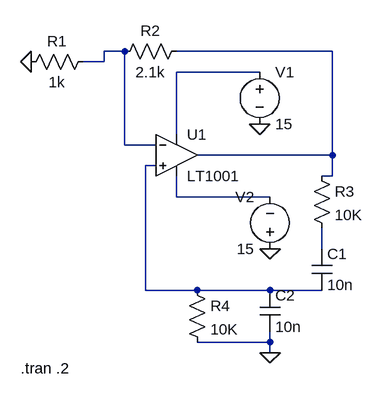
[diagram p0: schematic WEIN BRIDGE.asc]
WEIN BRIDGE.asc, the LTspice schematic file:
Version 4
SHEET 1 880 680
WIRE 128 0 96 0
WIRE 448 0 208 0
WIRE 96 16 96 0
WIRE 96 16 64 16
WIRE 336 32 208 32
WIRE 208 128 208 32
WIRE 128 144 128 0
WIRE 176 144 128 144
WIRE 448 160 448 0
WIRE 448 160 240 160
WIRE 176 176 160 176
WIRE 448 192 448 160
WIRE 448 192 432 192
WIRE 208 224 208 192
WIRE 352 224 208 224
WIRE 432 304 432 272
WIRE 160 368 160 176
WIRE 240 368 160 368
WIRE 352 368 240 368
WIRE 432 368 352 368
WIRE 352 448 352 432
WIRE 352 448 240 448
WIRE 352 464 352 448
FLAG 336 112 0
FLAG 352 304 0
FLAG -16 16 0
FLAG 352 464 0
SYMBOL OpAmps\\LT1001 208 96 R0
SYMATTR InstName U1
SYMBOL voltage 336 16 R0
SYMATTR InstName V1
SYMATTR Value 15
SYMBOL voltage 352 320 R180
WINDOW 0 24 96 Left 2
WINDOW 3 24 16 Left 2
WINDOW 123 0 0 Left 0
WINDOW 39 0 0 Left 0
SYMATTR InstName V2
SYMATTR Value 15
SYMBOL res 80 0 R90
WINDOW 0 0 56 VBottom 2
WINDOW 3 32 56 VTop 2
SYMATTR InstName R1
SYMATTR Value 1k
SYMBOL res 224 -16 R90
WINDOW 0 0 56 VBottom 2
WINDOW 3 32 56 VTop 2
SYMATTR InstName R2
SYMATTR Value 2.1k
SYMBOL res 416 176 R0
SYMATTR InstName R3
SYMATTR Value 10K
SYMBOL cap 416 304 R0
SYMATTR InstName C1
SYMATTR Value 10n
SYMBOL res 224 352 R0
SYMATTR InstName R4
SYMATTR Value 10K
SYMBOL cap 336 368 R0
SYMATTR InstName C2
SYMATTR Value 10n
TEXT -32 488 Left 2 !.tran .2

The netlist it stands for:
* WEIN BRIDGE.asc
XU1 N004 N001 N003 N005 N002 LT1001  ; pins In+ In- V+ V- OUT
V1 N003 0 15
V2 0 N005 15
R1 N001 0 1k
R2 N002 N001 2.1k
R3 N002 N006 10K
C1 N006 N004 10n
R4 N004 0 10K
C2 N004 0 10n
.tran .2
.lib LTC.lib
.backanno
.end